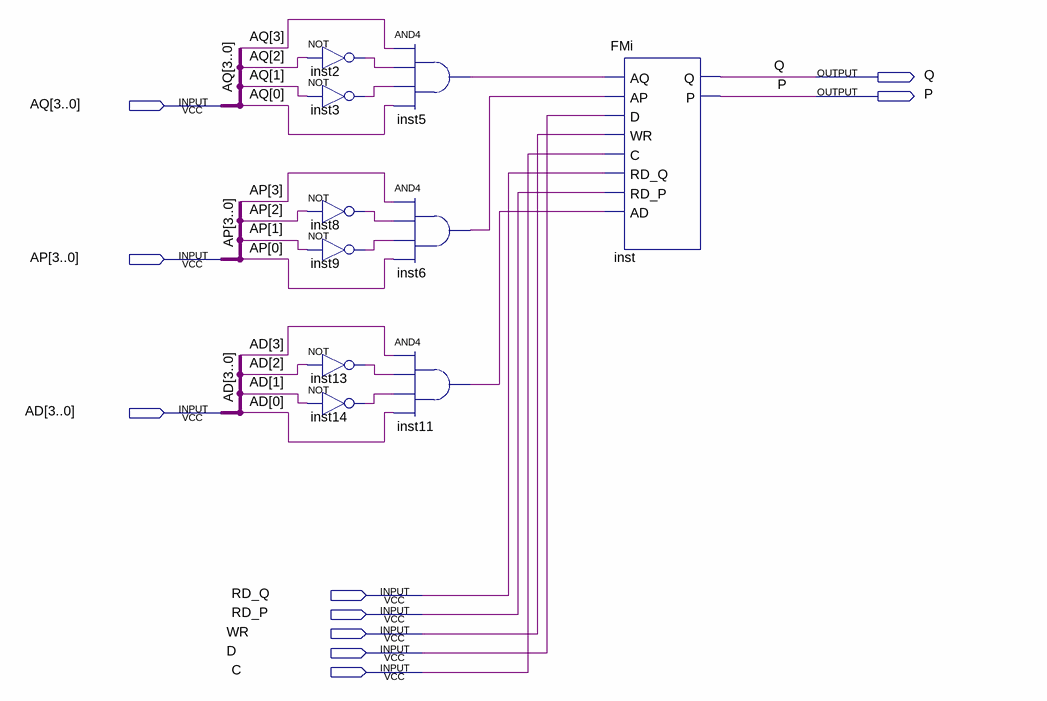
[diagram p0: schematic sheet]
// Quartus schematic FM1001.bdf as structural Verilog: 10 symbols, 10 pins
module FM1001 (
  input  [3:0] AQ,
  input  [3:0] AP,
  input  [3:0] AD,
  input  RD_Q,
  input  RD_P,
  input  WR,
  input  D,
  input  C,
  output Q,
  output P
);

  wire inst2_out, inst3_out, inst5_out, inst6_out, inst8_out, inst9_out, inst11_out, inst13_out, inst14_out;

  not inst2 (inst2_out, AQ[2]);
  not inst3 (inst3_out, AQ[1]);
  not inst8 (inst8_out, AP[2]);
  not inst9 (inst9_out, AP[1]);
  not inst13 (inst13_out, AD[2]);
  not inst14 (inst14_out, AD[1]);
  and inst5 (inst5_out, AQ[3], inst2_out, inst3_out, AQ[0]);
  and inst6 (inst6_out, AP[3], inst8_out, inst9_out, AP[0]);
  and inst11 (inst11_out, AD[3], inst13_out, inst14_out, AD[0]);
  FMi inst (
    .AQ(inst5_out), .AP(inst6_out), .D(D), .WR(WR), .C(C), .RD_Q(RD_Q), .RD_P(RD_P), .AD(inst11_out), .Q(Q),
    .P(P));
endmodule
